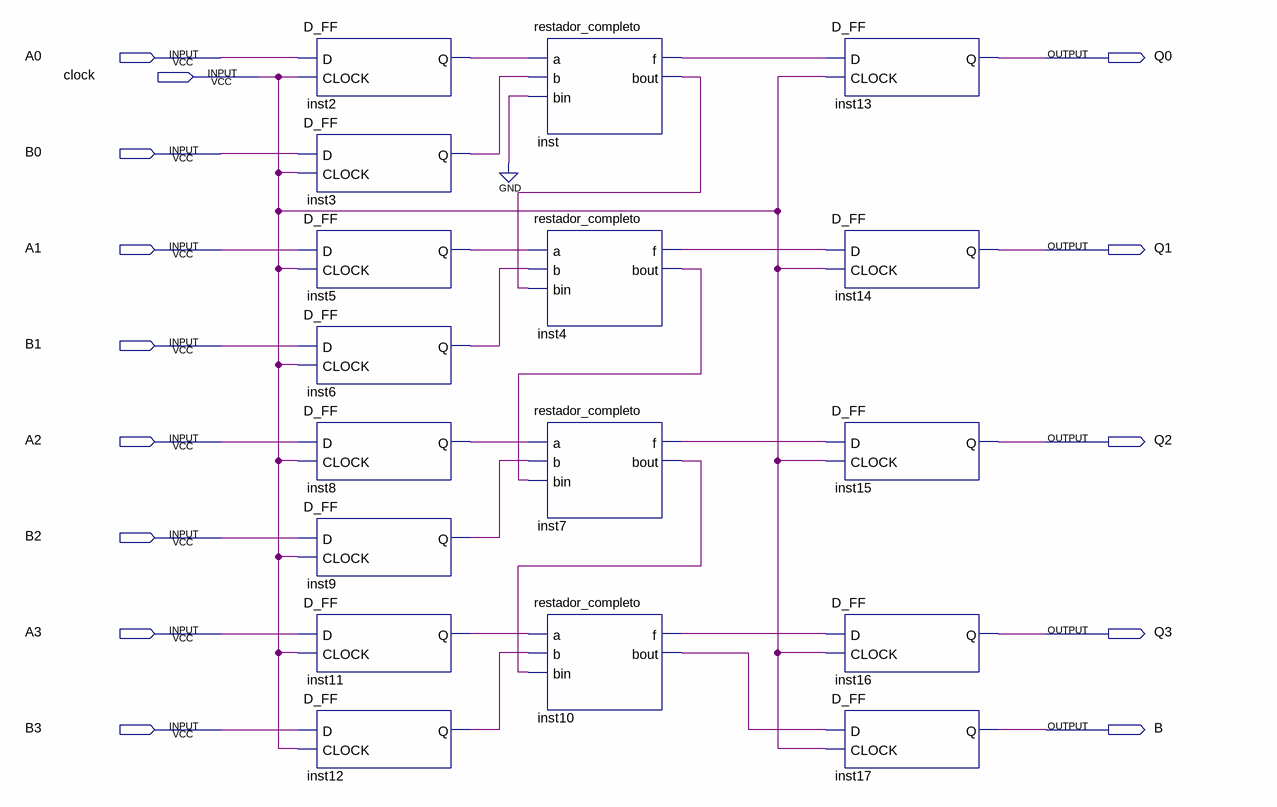
[diagram p0: schematic sheet]
// Quartus schematic Block1.bdf as structural Verilog: 17 symbols, 14 pins
module Block1 (
  input  A0,
  input  clock,
  input  B0,
  input  A1,
  input  B1,
  input  A2,
  input  B2,
  input  A3,
  input  B3,
  output Q0,
  output Q1,
  output Q2,
  output Q3,
  output B
);

  wire inst2_q, inst3_q, inst4_bout, inst4_f, inst5_q, inst6_q, inst7_bout, inst7_f, inst8_q, inst9_q,
       inst10_bout, inst10_f, inst11_q, inst12_q, inst_bout, inst_f;

  D_FF inst2 (.D(A0), .CLOCK(clock), .Q(inst2_q));
  D_FF inst3 (.D(B0), .CLOCK(clock), .Q(inst3_q));
  D_FF inst5 (.D(A1), .CLOCK(clock), .Q(inst5_q));
  D_FF inst6 (.D(B1), .CLOCK(clock), .Q(inst6_q));
  D_FF inst8 (.D(A2), .CLOCK(clock), .Q(inst8_q));
  D_FF inst9 (.D(B2), .CLOCK(clock), .Q(inst9_q));
  D_FF inst11 (.D(A3), .CLOCK(clock), .Q(inst11_q));
  D_FF inst12 (.D(B3), .CLOCK(clock), .Q(inst12_q));
  restador_completo inst (.a(inst2_q), .b(inst3_q), .bin(1'b0), .f(inst_f), .bout(inst_bout));
  restador_completo inst4 (.a(inst5_q), .b(inst6_q), .bin(inst_bout), .f(inst4_f), .bout(inst4_bout));
  restador_completo inst7 (.a(inst8_q), .b(inst9_q), .bin(inst4_bout), .f(inst7_f), .bout(inst7_bout));
  restador_completo inst10 (.a(inst11_q), .b(inst12_q), .bin(inst7_bout), .f(inst10_f), .bout(inst10_bout));
  D_FF inst13 (.D(inst_f), .CLOCK(clock), .Q(Q0));
  D_FF inst14 (.D(inst4_f), .CLOCK(clock), .Q(Q1));
  D_FF inst15 (.D(inst7_f), .CLOCK(clock), .Q(Q2));
  D_FF inst16 (.D(inst10_f), .CLOCK(clock), .Q(Q3));
  D_FF inst17 (.D(inst10_bout), .CLOCK(clock), .Q(B));
endmodule
